# Altium project shahbazi.PrjPcb
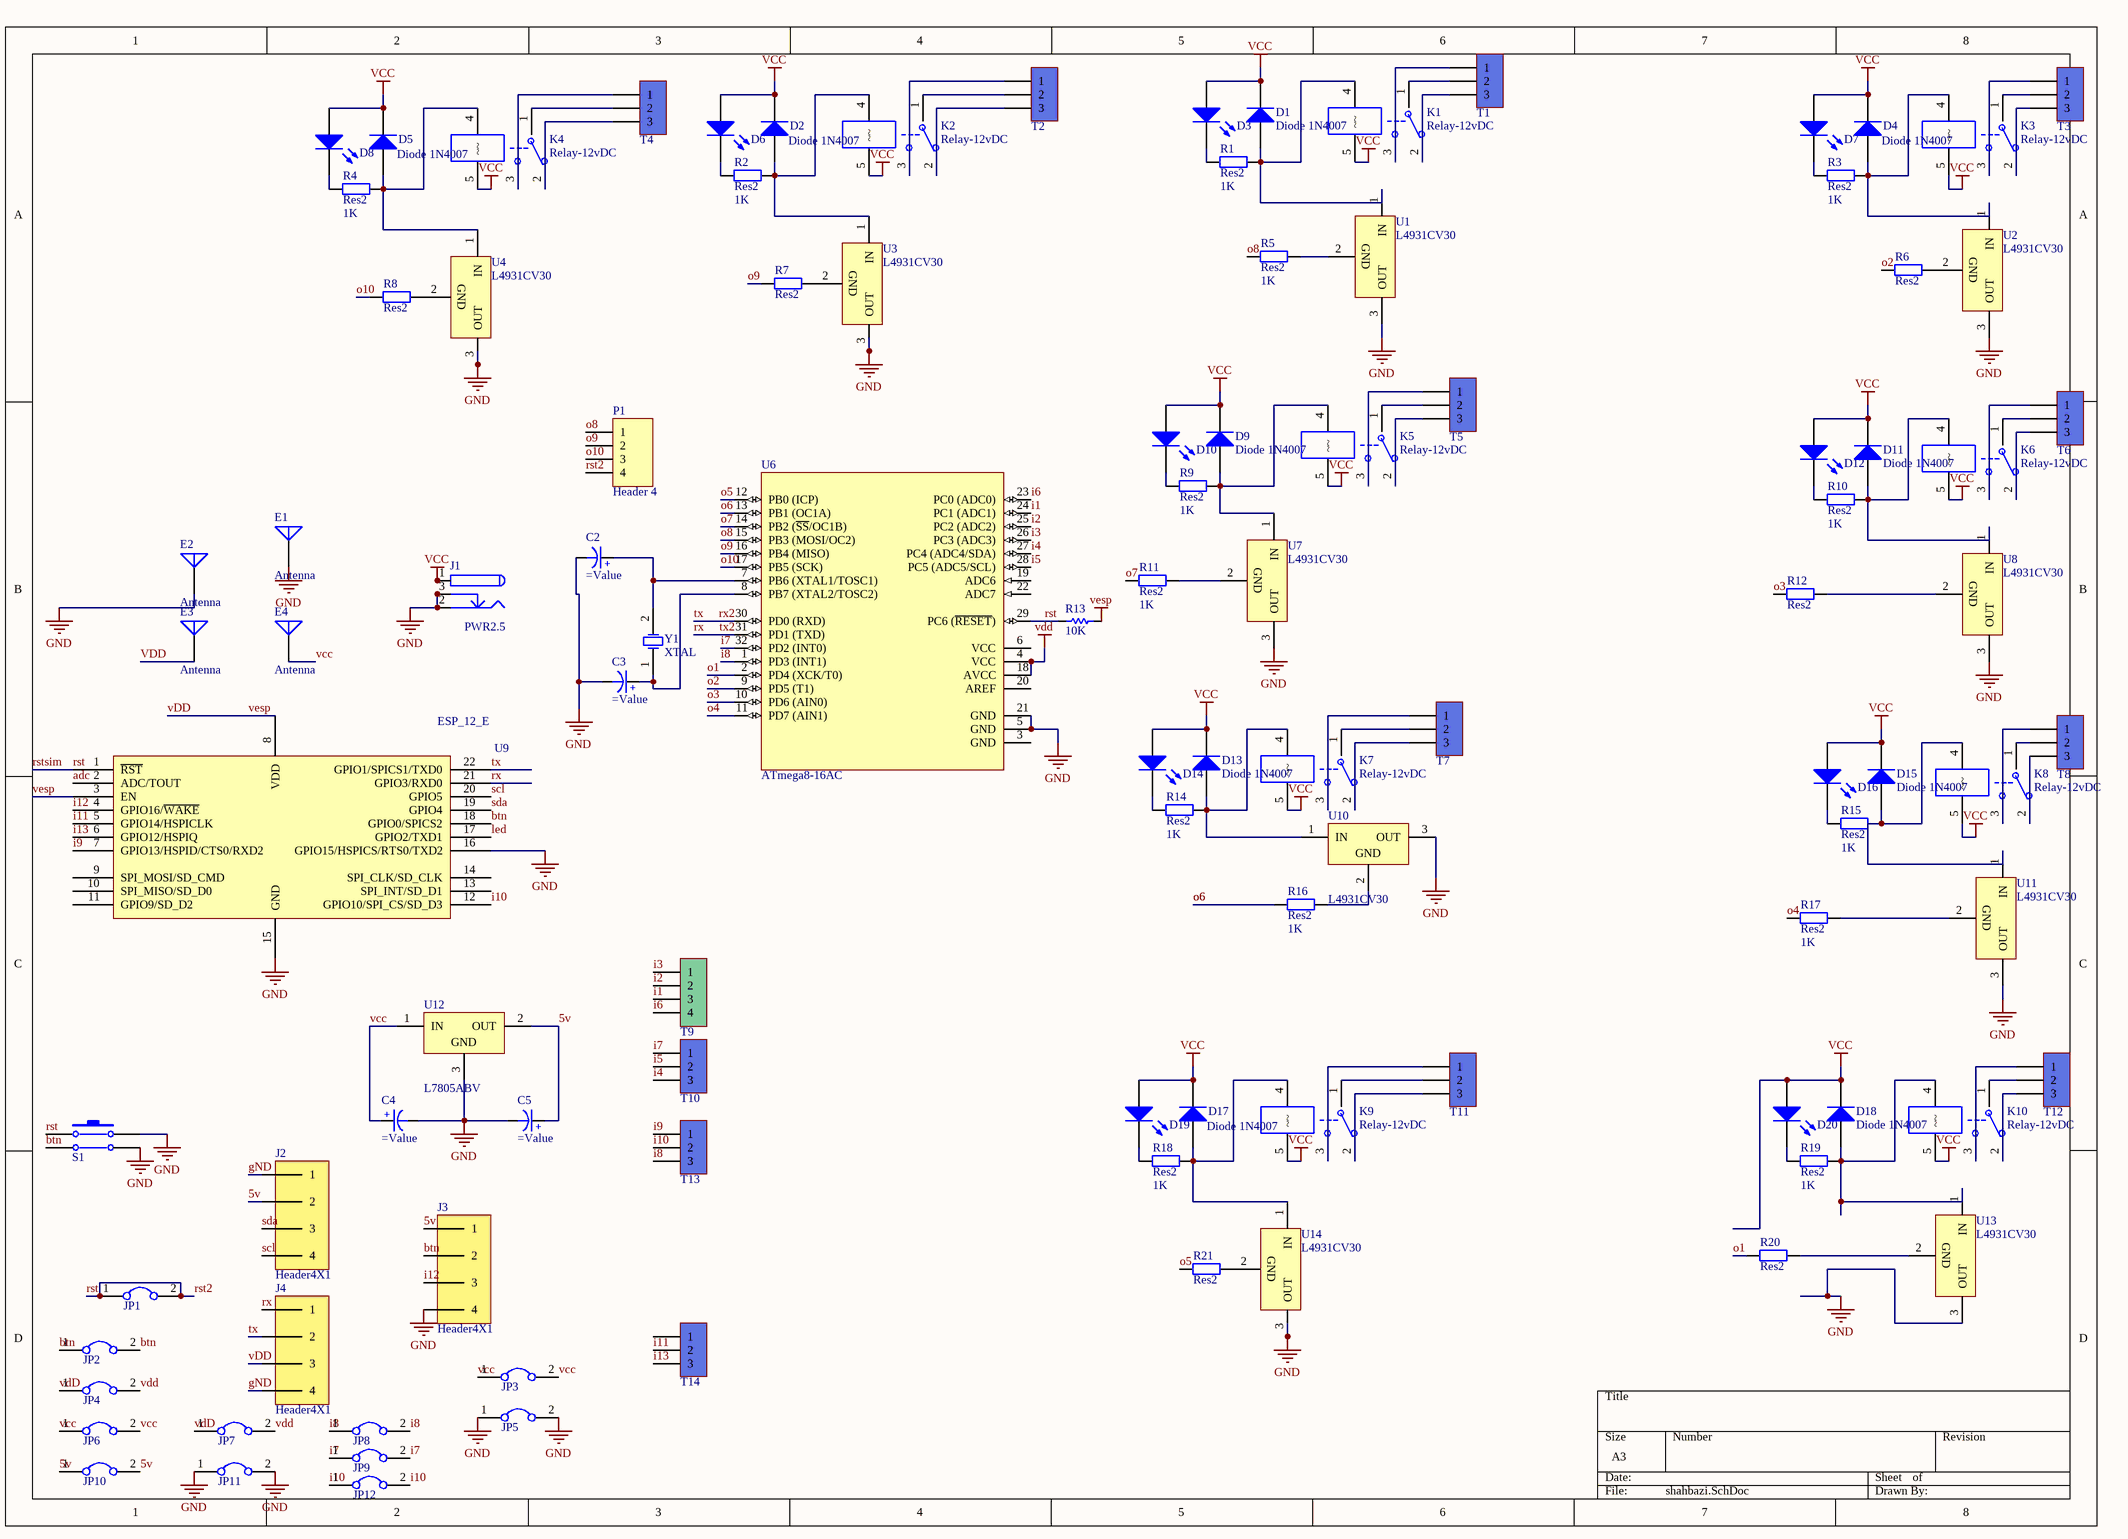
[diagram p0: shahbazi.SchDoc]
1 sheet, 105 parts. Net scope: global (net labels, ports and power ports of the same name join across sheets).
Board file: shahbazi.PcbDoc

## Sheet shahbazi.SchDoc
size A3

### Parts
C2  (no value)  [ELEC-CAP-RAD10-20]
C3  (no value)  [ELEC-CAP-RAD10-20]
C4  (no value)  [ELEC-CAP-RAD10-20]
C5  (no value)  [ELEC-CAP-RAD10-20]
D1  Diode 1N4007  [DO-41]
D2  Diode 1N4007  [DO-41]
D3  LED 3mm  [LED-3mm]  (value not drawn)
D4  Diode 1N4007  [DO-41]
D5  Diode 1N4007  [DO-41]
D6  LED 3mm  [LED-3mm]  (value not drawn)
D7  LED 3mm  [LED-3mm]  (value not drawn)
D8  LED 3mm  [LED-3mm]  (value not drawn)
D9  Diode 1N4007  [DO-41]
D10  LED 3mm  [LED-3mm]  (value not drawn)
D11  Diode 1N4007  [DO-41]
D12  LED 3mm  [LED-3mm]  (value not drawn)
D13  Diode 1N4007  [DO-41]
D14  LED 3mm  [LED-3mm]  (value not drawn)
D15  Diode 1N4007  [DO-41]
D16  LED 3mm  [LED-3mm]  (value not drawn)
D17  Diode 1N4007  [DO-41]
D18  Diode 1N4007  [DO-41]
D19  LED 3mm  [LED-3mm]  (value not drawn)
D20  LED 3mm  [LED-3mm]  (value not drawn)
E1  Antenna  [PIN1]
E2  Antenna  [PIN1]
E3  Antenna  [PIN1]
E4  Antenna  [PIN1]
J1  PWR2.5  [KLD-0202]
J2  Header4X1  [HEADER 4X1]
J3  Header4X1  [HEADER 4X1]
J4  Header4X1  [HEADER 4X1]
JP1  Jumper  [Header 2X1]  (value not drawn)
JP2  Jumper  [Header 2X1]  (value not drawn)
JP3  Jumper  [Header 2X1]  (value not drawn)
JP4  Jumper  [Header 2X1]  (value not drawn)
JP5  Jumper  [Header 2X1]  (value not drawn)
JP6  Jumper  [Header 2X1]  (value not drawn)
JP7  Jumper  [Header 2X1]  (value not drawn)
JP8  Jumper  [Header 2X1]  (value not drawn)
JP9  Jumper  [Header 2X1]  (value not drawn)
JP10  Jumper  [Header 2X1]  (value not drawn)
JP11  Jumper  [Header 2X1]  (value not drawn)
JP12  Jumper  [Header 2X1]  (value not drawn)
K1  Relay-12vDC  [Relays]
K2  Relay-12vDC  [Relays]
K3  Relay-12vDC  [Relays]
K4  Relay-12vDC  [Relays]
K5  Relay-12vDC  [Relays]
K6  Relay-12vDC  [Relays]
K7  Relay-12vDC  [Relays]
K8  Relay-12vDC  [Relays]
K9  Relay-12vDC  [Relays]
K10  Relay-12vDC  [Relays]
P1  Header 4  [HDR1X4]
R1  Res2  value 1K  [Res50]
R2  Res2  value 1K  [Res50]
R3  Res2  value 1K  [Res50]
R4  Res2  value 1K  [Res50]
R5  Res2  value 1K  [Res50]
R6  Res2  [Res50]
R7  Res2  [Res50]
R8  Res2  [Res50]
R9  Res2  value 1K  [Res50]
R10  Res2  value 1K  [Res50]
R11  Res2  value 1K  [Res50]
R12  Res2  [Res50]
R13  10K  [RES 1206 (3216X08L)]
R14  Res2  value 1K  [Res50]
R15  Res2  value 1K  [Res50]
R16  Res2  value 1K  [Res50]
R17  Res2  value 1K  [Res50]
R18  Res2  value 1K  [Res50]
R19  Res2  value 1K  [Res50]
R20  Res2  [Res50]
R21  Res2  [Res50]
S1  PUSH BUTTON DOUBLE  [PUSH BUTTON]  (value not drawn)
T1  Terminal  [phoenix terminal R 3]  (value not drawn)
T2  Terminal  [phoenix terminal R 3]  (value not drawn)
T3  Terminal  [phoenix terminal R 3]  (value not drawn)
T4  Terminal  [phoenix terminal R 3]  (value not drawn)
T5  Terminal  [phoenix terminal R 3]  (value not drawn)
T6  Terminal  [phoenix terminal R 3]  (value not drawn)
T7  Terminal  [phoenix terminal R 3]  (value not drawn)
T8  Terminal  [phoenix terminal R 3]  (value not drawn)
T9  Phoenix terminal  [phoenix terminal 4]  (value not drawn)
T10  Terminal  [phoenix terminal R 3]  (value not drawn)
T11  Terminal  [phoenix terminal R 3]  (value not drawn)
T12  Terminal  [phoenix terminal R 3]  (value not drawn)
T13  Terminal  [phoenix terminal R 3]  (value not drawn)
T14  Terminal  [phoenix terminal R 3]  (value not drawn)
U1  L4931CV30  [TO-220A]
U2  L4931CV30  [TO-220A]
U3  L4931CV30  [TO-220A]
U4  L4931CV30  [TO-220A]
U6  ATmega8-16AC  [32A_N]
U7  L4931CV30  [TO-220A]
U8  L4931CV30  [TO-220A]
U9  ESP_12_E  [ESP_12_E]
U10  L4931CV30  [TO-220A]
U11  L4931CV30  [TO-220A]
U12  L7805ABV  [TO220ABN]
U13  L4931CV30  [TO-220A]
U14  L4931CV30  [TO-220A]
Y1  XTAL  [R38]

### Nets
gND: C2.1(-) C3.1(-) C4.1(-) C5.1(-) E1.1(A) E2.1(A) J1.2 J1.2A J1.2B J1.3 J1.3A J1.3B J2.1 J3.4 J4.4 JP5.1 JP5.2 JP11.1 JP11.2 S1.2 S1.4 U1.3(OUT) U2.3(OUT) U3.3(OUT) U4.3(OUT) U6.5(GND) U6.21(GND) U7.3(OUT) U8.3(OUT) U9.15(GND) U9.16(GPIO15/HSPICS/RTS0/TXD2) U10.3(OUT) U11.3(OUT) U12.3(GND) U13.3(OUT) U14.3(OUT)
vcc: C4.2(+) D1.2(K) D2.2(K) D3.1(A) D4.2(K) D5.2(K) D6.1(A) D7.1(A) D8.1(A) D9.2(K) D10.1(A) D11.2(K) D12.1(A) D13.2(K) D14.1(A) D15.2(K) D16.1(A) D17.2(K) D18.2(K) D19.1(A) D20.1(A) E4.1(A) J1.1 J1.1A J1.1B JP3.1 JP3.2 JP6.1 JP6.2 K1.5 K2.5 K3.5 K4.5 K5.5 K6.5 K7.5 K8.5 K9.5 K10.5 U12.1(IN)
VDD: E3.1(A) J4.3 JP4.1 JP4.2 JP7.1 JP7.2 R13.2 U6.4(VCC) U6.18(AVCC) U9.3(EN) U9.8(VDD)  [also labelled vesp]
5v: C5.2(+) J2.2 J3.1 JP10.1 JP10.2 U12.2(OUT)
adc: U9.2(ADC/TOUT)
btn: J3.2 JP2.1 JP2.2 S1.3 U9.18(GPIO0/SPICS2)
i1: T9.3 U6.24(PC1_(ADC1))
i2: T9.2 U6.25(PC2_(ADC2))
i3: T9.1 U6.26(PC3_(ADC3))
i4: T10.3 U6.27(PC4_(ADC4/SDA))
i5: T10.2 U6.28(PC5_(ADC5/SCL))
i6: T9.4 U6.23(PC0_(ADC0))
i7: JP9.1 JP9.2 T10.1 U6.32(PD2_(INT0))
i8: JP8.1 JP8.2 T13.3 U6.1(PD3_(INT1))
i9: T13.1 U9.7(GPIO13/HSPID/CTS0/RXD2)
i10: JP12.1 JP12.2 T13.2 U9.12(GPIO10/SPI_CS/SD_D3)
i11: T14.2 U9.5(GPIO14/HSPICLK)
i12: J3.3 U9.4(GPIO16/~{WAKE})
i13: T14.3 U9.6(GPIO12/HSPIQ)
led: U9.17(GPIO2/TXD1)
o1: R20.1 U6.2(PD4_(XCK/T0))
o2: R6.1 U6.9(PD5_(T1))
o3: R12.1 U6.10(PD6_(AIN0))
o4: R17.1 U6.11(PD7_(AIN1))
o5: R21.1 U6.12(PB0_(ICP))
o6: R16.1 U6.13(PB1_(OC1A))
o7: R11.1 U6.14(PB2_(~{SS}/OC1B))
o8: P1.1 R5.1 U6.15(PB3_(MOSI/OC2))
o9: P1.2 R7.1 U6.16(PB4_(MISO))
o10: P1.3 R8.1 U6.17(PB5_(SCK))
rst: JP1.1 JP1.2 P1.4 R13.1 S1.1 U6.29(PC6_(~{RESET})) U9.1(~{RST})  [also labelled rst2, rstsim]
rx: J4.1 U6.31(PD1_(TXD)) U9.21(GPIO3/RXD0)  [also labelled tx2]
rx2: J4.2 U6.30(PD0_(RXD)) U9.22(GPIO1/SPICS1/TXD0)  [also labelled tx]
scl: J2.4 U9.20(GPIO5)
sda: J2.3 U9.19(GPIO4)
NetC2_2: C2.2(+) U6.7(PB6_(XTAL1/TOSC1)) Y1.2(OSC2)
NetC3_2: C3.2(+) U6.8(PB7_(XTAL2/TOSC2)) Y1.1(OSC1)
NetD1_1: D1.1(A) K1.4 R1.2 U1.1(IN)
NetD2_1: D2.1(A) K2.4 R2.2 U3.1(IN)
NetD3_2: D3.2(K) R1.1
NetD4_1: D4.1(A) K3.4 R3.2 U2.1(IN)
NetD5_1: D5.1(A) K4.4 R4.2 U4.1(IN)
NetD6_2: D6.2(K) R2.1
NetD7_2: D7.2(K) R3.1
NetD8_2: D8.2(K) R4.1
NetD9_1: D9.1(A) K5.4 R9.2 U7.1(IN)
NetD10_2: D10.2(K) R9.1
NetD11_1: D11.1(A) K6.4 R10.2 U8.1(IN)
NetD12_2: D12.2(K) R10.1
NetD13_1: D13.1(A) K7.4 R14.2 U10.1(IN)
NetD14_2: D14.2(K) R14.1
NetD15_1: D15.1(A) K8.4 R15.2 U11.1(IN)
NetD16_2: D16.2(K) R15.1
NetD17_1: D17.1(A) K9.4 R18.2 U14.1(IN)
NetD18_1: D18.1(A) K10.4 R19.2 U13.1(IN)
NetD19_2: D19.2(K) R18.1
NetD20_2: D20.2(K) R19.1
NetK1_1: K1.1(COM) T1.2
NetK1_2: K1.2(NC) T1.3
NetK1_3: K1.3(NO) T1.1
NetK2_1: K2.1(COM) T2.2
NetK2_2: K2.2(NC) T2.3
NetK2_3: K2.3(NO) T2.1
NetK3_1: K3.1(COM) T3.2
NetK3_2: K3.2(NC) T3.3
NetK3_3: K3.3(NO) T3.1
NetK4_1: K4.1(COM) T4.2
NetK4_2: K4.2(NC) T4.3
NetK4_3: K4.3(NO) T4.1
NetK5_1: K5.1(COM) T5.2
NetK5_2: K5.2(NC) T5.3
NetK5_3: K5.3(NO) T5.1
NetK6_1: K6.1(COM) T6.2
NetK6_2: K6.2(NC) T6.3
NetK6_3: K6.3(NO) T6.1
NetK7_1: K7.1(COM) T7.2
NetK7_2: K7.2(NC) T7.3
NetK7_3: K7.3(NO) T7.1
NetK8_1: K8.1(COM) T8.2
NetK8_2: K8.2(NC) T8.3
NetK8_3: K8.3(NO) T8.1
NetK9_1: K9.1(COM) T11.2
NetK9_2: K9.2(NC) T11.3
NetK9_3: K9.3(NO) T11.1
NetK10_1: K10.1(COM) T12.2
NetK10_2: K10.2(NC) T12.3
NetK10_3: K10.3(NO) T12.1
NetR5_2: R5.2 U1.2(GND)
NetR6_2: R6.2 U2.2(GND)
NetR7_2: R7.2 U3.2(GND)
NetR8_2: R8.2 U4.2(GND)
NetR11_2: R11.2 U7.2(GND)
NetR12_2: R12.2 U8.2(GND)
NetR16_2: R16.2 U10.2(GND)
NetR17_2: R17.2 U11.2(GND)
NetR20_2: R20.2 U13.2(GND)
NetR21_2: R21.2 U14.2(GND)

Not connected (* = marked no-connect by the designer): T14 1; U6 3(GND) 6(VCC) 19(ADC6) 20(AREF) 22(ADC7); U9 9(SPI_MOSI/SD_CMD) 10(SPI_MISO/SD_D0) 11(GPIO9/SD_D2) 13(SPI_INT/SD_D1) 14(SPI_CLK/SD_CLK)

### Library data of the parts
C2-C5 = Capacitor Electrolytic: Electrolytic Capacitor
D1 D2 D4 D5 D9 D11 D13 D15 D17 D18 = Diode 1N4007: 1 Amp General Purpose Rectifier; Published: 8-Jun-2000; LatestRevisionDate: 17-Jul-2002; LatestRevisionNote: Re-released for DXP Platform.; DatasheetVersion: 1998; PackageVersion: Aug-1999; PackageReference: DO-41; Publisher: Altium Limited; PackageDescription: Diode, Axial; Body 5.2 x 2.7 mm (LxDia. max), Lead Dia. 0.86 mm (max); Code_JEDEC: DO-204-AL; ComponentLink1Description: Manufacturer Link; ComponentLink1URL: http://www.fairchildsemi.com/; ComponentLink2Description: Datasheet; ComponentLink2URL: http://www.fairchildsemi.com/ds/1N%2F1N4001.pdf
D3 D6-D8 D10 D12 D14 D16 D19 D20 = LED 3mm: Typical LED; Designer: Seyed Mohsen Ghasemian; Published: 02/04/2012; PackageReference: LED; Publisher: www.picpars.com; PackageDescription: LED; 2 Leads
E1-E4 = Antenna: Generic Antenna; Published: 24-Mar-1999; LatestRevisionDate: 17-Jul-2002; LatestRevisionNote: Re-released for DXP Platform.; PackageReference: PIN1; Publisher: Altium Limited
J1 = PWR2.5: Low Voltage Power Supply Connector; Published: 17-Dec-2003; DatasheetDocument: 09-May-2002; Publisher: Altium Limited; ComponentLink1Description: Manufacturer Link; ComponentLink1URL: http://domino.kycon.com/internet/Products.html
K1-K10 = Relay-05vDC: Relay-05vDC-240AC 5A; Designer: Seyed Mohsen Ghasemain; ComponentLinkURL: www.picpars.com
P1 = Header 4: Header, 4-Pin; LatestRevisionDate: 17-Jul-2002; LatestRevisionNote: Re-released for DXP Platform.; Publisher: Altium Limited
R1-R12 R14-R21 = Res2: Resistor; Published: 8-Jun-2000; LatestRevisionDate: 17-Jul-2002; LatestRevisionNote: Re-released for DXP Platform.; Publisher: Altium Limited; PackageDescription: Axial Device, Thru-Hole; 2 Leads; 0.4 in Pin Spacing
  R1-R12 R15-R21: PackageReference: AXIAL-0.4
  R14: PackageReference: Res50
R13 = Resistor: Tolerance: 5%; Power: 1/4 W; Value: 10K
S1 = PUSH BUTTON DOUBLE: Switch
T1-T8 T11 T12 = Terminal 1*3: phoenix terminal R 3; Designer: Seyed Mohsen Ghasemain; E-mail: picpars@gmail.com; ComponentLinkURL: www.picpars.com
T9 = Phoenix terminal 4: Terminal 4 Pin; Designer: Seyed Mohsen Ghasemain; E-mail: picpars@gmail.com; ComponentLinkURL: www.picpars.com
T10 T13 T14 = Terminal 1*3: Terminal 3 Pin 250VAC 16A; Designer: Seyed Mohsen Ghasemain; E-mail: picpars@gmail.com; ComponentLinkURL: www.picpars.com
U1-U4 U7 U8 U10 U11 U13 U14 = L4931CV30: 250mA, Very Low Drop ( 0.4V) Voltage Regulator; Published: 24-Aug-2001; LatestRevisionDate: 06-Jun-2005; LatestRevisionNote: PCB Pin sequence re-ordered.; DatasheetVersion: Apr-1999; PackageVersion: Jul-2004; PackageReference: TO-220A; Publisher: Altium Limited; PackageDescription: TO, Thru-Hole, Vertical, Heatsink Mounted; 3 In-Line Leads; Pitch 2.54 mm; ComponentLink1Description: Manufacturer Link; ComponentLink1URL: http://www.st.com/; ComponentLink2Description: Datasheet; ComponentLink2URL: http://www.st.com/stonline/products/literature/ds/4340/l4931abxx15.pdf
U6 = ATmega8-16AC: 8-Bit AVR Microcontroller with 8K Bytes of In-System Programmable Flash Memory; Published: 17-Sep-2003; LatestRevisionDate: 16-Oct-2006; LatestRevisionNote: IPC-7351 Footprint Added.; DatasheetVersion: 2486H-AVR-09/02; PackageVersion: revB, Oct-2001; PackageReference: 32A; Publisher: Altium Limited; PackageDescription: 32-Lead, 7x7x1.0 mm Body, 0.8mm Lead Pitch, Thin Profile Plastic Quad Flat Package (TQFP); Supplier 1: Digi-Key; Supplier Part Number 1: ATMEGA8-16AC-ND; Supplier 2: Mouser; Supplier Part Number 2: 556-ATMEGA8-16AC; Code_JEDEC: MS-026-ABA; ComponentLink1Description: Datasheet; ComponentLink1URL: http://www.atmel.com/dyn/resources/prod_documents/doc2486.pdf; ComponentLink2Description: Atmel.com Home; ComponentLink2URL: http://www.atmel.com
U9 = ESP_12_E: ESP-12 Wi-Fi Module by AI-Thinker; IC: ESP8266-EX; Vendor: Ai-thinker
U12 = L7805ABV: Precision 1A Regulator; Note: Tab is connected to pin 3 (GND).; Published: 24-Aug-2001; LatestRevisionDate: 17-Jul-2002; LatestRevisionNote: Re-released for DXP Platform.; DatasheetVersion: Nov-1999; PackageVersion: Jun-1998; PackageReference: TO220ABN; Publisher: Altium Limited; PackageDescription: TO, Thru-Hole, Vertical, Heatsink Mounted; 3 In-Line Leads; Pitch 2.54 mm; Pin sequence 1, 3, 2; ComponentLink1Description: Manufacturer Link; ComponentLink1URL: http://www.st.com/; ComponentLink2Description: Datasheet; ComponentLink2URL: http://www.st.com/stonline/products/literature/ds/2144/l7805ab.pdf
Y1 = XTAL: Crystal Oscillator; Published: 8-Jun-2000; LatestRevisionDate: 17-Jul-2002; LatestRevisionNote: Re-released for DXP Platform.; PackageReference: R38; Publisher: Altium Limited; PackageDescription: Crystal, Thru-Hole; 2 Leads; Body 3.1 x 8.2 mm (Dia.xH)